# Altium schematic sheet Sender_Power.SchDoc
size A4
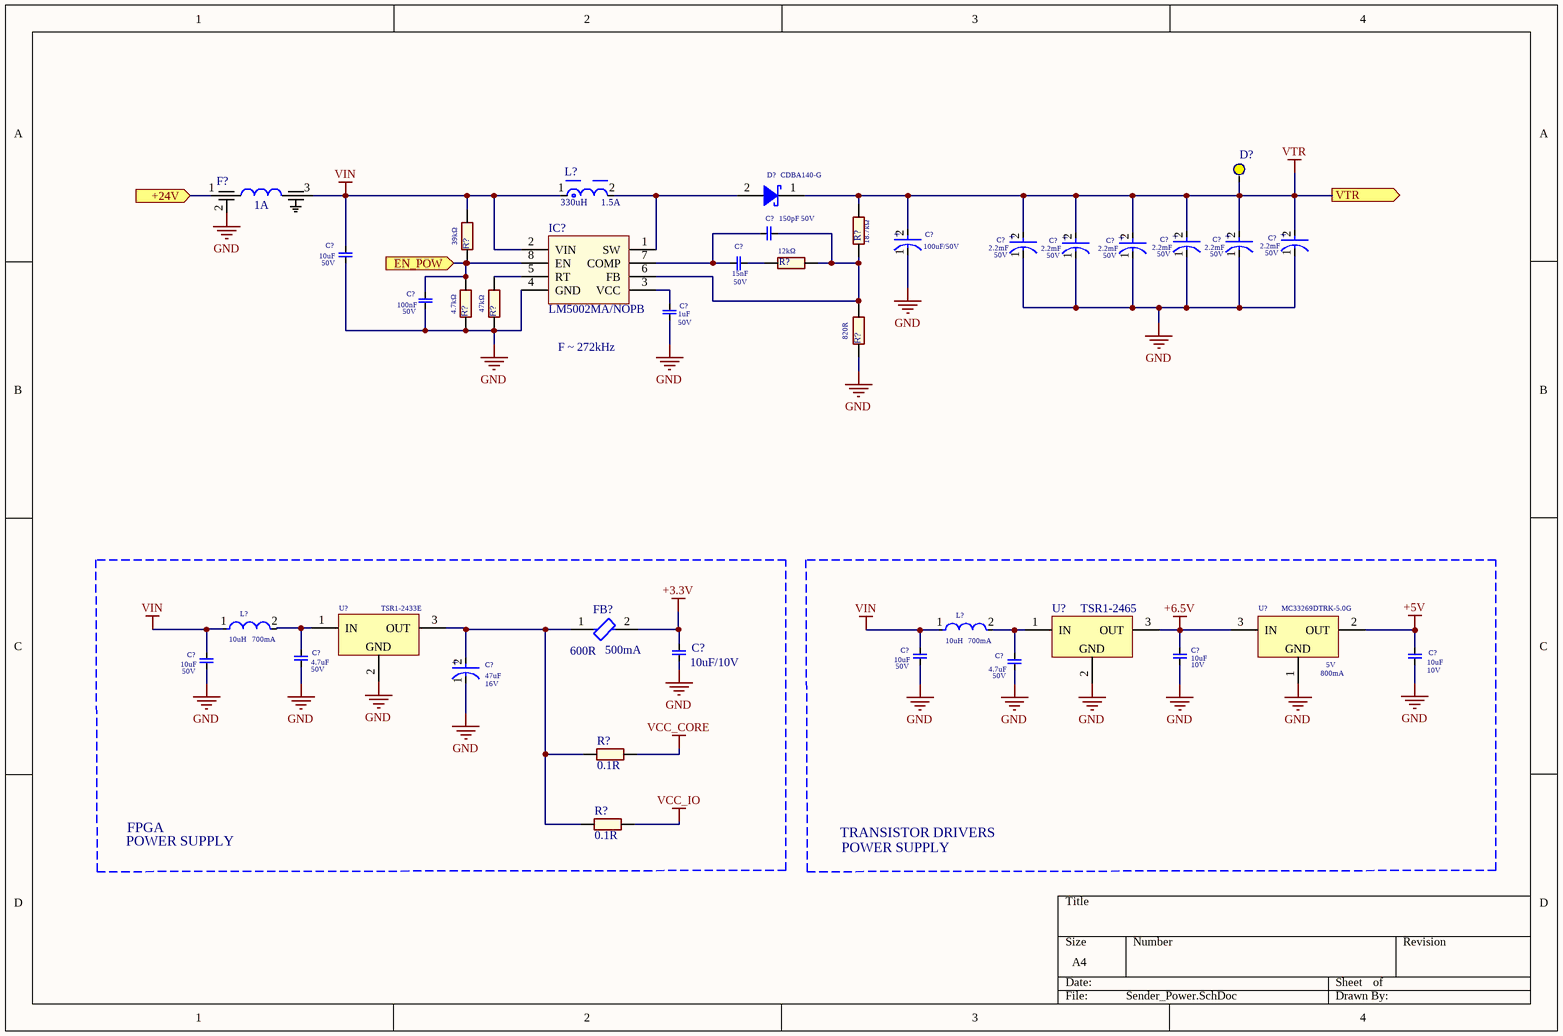
[diagram p0: Sender_Power.SchDoc]

## Parts
(Parts that share a designator on the sheet are numbered #1, #2 ... from top to bottom, then left to right.)
C?#1  100uF/50V  [FP-SGV8X10_5-MFG]
C?#2  Capacitance: 2.2mF  Voltage Rating: 50V  [FP-228CKE050MQW]  (hidden comment: 2200uF/50V)
C?#3  Capacitance: 2.2mF  Voltage Rating: 50V  [FP-228CKE050MQW]  (hidden comment: 2200uF/50V)
C?#4  Capacitance: 2.2mF  Voltage Rating: 50V  [FP-228CKE050MQW]  (hidden comment: 2200uF/50V)
C?#5  Capacitance: 150pF  Voltage Rating: 50V  [FP-CL10-IPC_B]  (hidden comment: 150pF / 50 VDC)
C?#6  Capacitance: 2.2mF  Voltage Rating: 50V  [FP-228CKE050MQW]  (hidden comment: 2200uF/50V)
C?#7  Capacitance: 2.2mF  Voltage Rating: 50V  [FP-228CKE050MQW]  (hidden comment: 2200uF/50V)
C?#8  Capacitance: 2.2mF  Voltage Rating: 50V  [FP-228CKE050MQW]  (hidden comment: 2200uF/50V)
C?#9  Voltage Rating: 50V  Capacitance: 10uF  [CAP-1210 10u/50V]  (hidden comment: 10uF/50V)
C?#10  Capacitance: 15nF  Voltage Rating (DC): 50V  [FP-0603-UMK107BJ104KAHT-IPC_B]  (hidden comment: 15nF / 50 VDC)
C?#11  Voltage Rating: 50V  Capacitance: 100nF  [FP-0603-UMK107BJ104KAHT-IPC_B]  (hidden comment: 100nF/50 VDC)
C?#12  Capacitance: 1uF  Voltage Rating: 50V  [FP-0603-UMK107BJ104KAHT-IPC_B]  (hidden comment: 1uF / 50 VDC)
C?#13  Capacitance: 10uF  Voltage: 50V  [CAP-1210 10u/50V]  (hidden comment: 10uF/50V)
C?#14  Capacitance: 4.7uF  Voltage: 50V  [FP-C2012X7R1H475K125AC-IPC_B]  (hidden comment: 4.7uF/50V)
C?#15  Capacitance: 47uF  Voltage Rating: 16V  [FP-T491C476K016AT-MFG]  (hidden comment: 47uF/16V)
C?#16  10uF/10V  [FP-CL31-IPC_B]
C?#17  Capacitance: 10uF  Voltage: 50V  [CAP-1210 10u/50V]  (hidden comment: 10uF/50V)
C?#18  Capacitance: 10uF  Voltage Rating (DC): 10V  [FP-LMK107BJ106MALTD-IPC_B]  (hidden comment: 10uF/10V)
C?#19  Capacitance: 10uF  Voltage Rating (DC): 10V  [FP-LMK107BJ106MALTD-IPC_B]  (hidden comment: 10uF/10V)
C?#20  Capacitance: 4.7uF  Voltage: 50V  [FP-C2012X7R1H475K125AC-IPC_B]  (hidden comment: 4.7uF/50V)
D?#1  Test_Point  [Test_Point]  (value not drawn)
D?#2  CDBA140-G  [FP-SMA-MFG]
F?  Max DC Current: 1A  [Filter_SBSPP0500]  (hidden comment: FILTER LC(PI) 0.068UF SMD)
FB?  Impedance: 600R  Max DC Current: 500mA  [BLM18AG601SN1D]  (hidden comment: BLM18AG601SN1D)
IC?  Manufacturer Part Number: LM5002MA/NOPB  [D0008A_M]  (hidden comment: IC REG MULTI CONFG ADJ 8SOIC)
L?#1  Inductance: 330uH  RMS Current (Irms): 1.5A  [FP-7447709680-MFG]  (hidden comment: 7447709331)
L?#2  Current Rating: 700mA  Inductance: 10uH  [FP-MLP2520M-IPC_A]  (hidden comment: MLP2520S100MT0S1)
L?#3  Current Rating: 700mA  Inductance: 10uH  [FP-MLP2520M-IPC_A]  (hidden comment: MLP2520S100MT0S1)
R?#1  Resistance: 18.7kΩ  [RES 0603_1608]  (hidden comment: RC0603FR-0718K7L)
R?#2  Resistance: 39kΩ  [RES 0603_1608]  (hidden comment: RC0603FR-0739KL)
R?#3  Resistance: 12kΩ  [RES 0603_1608]
R?#4  Resistance: 4.7kΩ  [RES 0603_1608]  (hidden comment: RC0603FR-074K7L)
R?#5  Resistance: 47kΩ  [RES 0603_1608]
R?#6  Resistance: 820R  [RES 0603_1608]
R?#7  0.1R  [FP-LTR10-low-IPC_B]
R?#8  0.1R  [FP-LTR10-low-IPC_B]
U?#1  Manufacturer Part Number: TSR1-2433E  [TRACO-SIP-3_V]  (hidden comment: DC DC CONVERTER 3.3V)
U?#2  Manufacturer Part Number: TSR1-2465  [TRACO-SIP-3_V]  (hidden comment: TSR 1-2465)
U?#3  Nominal Output Voltage: 5V  Max Output Current: 800mA  [DPAK]  (hidden comment: IC REG LINEAR 5V 800MA DPAK)

## Ports
+24V (in), EN_POW (in), VTR (out)

## Nets
+3.3V: C?#16.1(G) FB?.2
+5V: C?#19.2(G) U?#3.2(OUT)
+6.5V: C?#18.2(G) U?#2.3(OUT) U?#3.3(IN)
GND: C?#1.1(C) C?#2.1(C) C?#3.1(C) C?#4.1(C) C?#6.1(C) C?#7.1(C) C?#8.1(C) C?#9.2(G) C?#11.1(G) C?#12.2(G) C?#13.1(G) C?#14.1(G) C?#15.1(C) C?#16.2(G) C?#17.1(G) C?#18.1(G) C?#19.1(G) C?#20.1(G) F?.2 IC?.4(GND) R?#4.1 R?#5.1 R?#6.1 U?#1.2(GND) U?#2.2(GND) U?#3.1(GND)
VCC_CORE: R?#7.2
VCC_IO: R?#8.2
VIN: C?#9.1(G) C?#13.2(G) C?#17.2(G) F?.3 IC?.2(VIN) L?#1.1 L?#2.1 L?#3.1 R?#2.2
VTR: C?#1.2(A) C?#2.2(A) C?#3.2(A) C?#4.2(A) C?#6.2(A) C?#7.2(A) C?#8.2(A) D?#1.1 D?#2.1(K) R?#1.2 ; port VTR
+24V: F?.1 ; port +24V
EN_POW: C?#11.2(G) IC?.8(EN) R?#2.1 R?#4.2 ; port EN_POW
NetC?#5_1: C?#5.1(G) C?#10.1(G) IC?.7(COMP)
NetC?#5_2: C?#5.2(G) IC?.6(FB) R?#1.1 R?#3.2 R?#6.2
NetC?#10_2: C?#10.2(G) R?#3.1
NetC?#12_1: C?#12.1(G) IC?.3(VCC)
NetC?#14_2: C?#14.2(G) L?#2.2 U?#1.1(IN)
NetC?#15_2: C?#15.2(A) FB?.1 R?#7.1 R?#8.1 U?#1.3(OUT)
NetC?#20_2: C?#20.2(G) L?#3.2 U?#2.1(IN)
NetD?#2_2: D?#2.2(A) IC?.1(SW) L?#1.2
NetIC?_5: IC?.5(RT) R?#5.2

## Notes on the sheet
- F ~ 272kHz
- POWER SUPPLY
- FPGA
- TRANSISTOR DRIVERS
- (in symbol 50SEV100M8X10.5) +
- (in symbol 228CKE050MQW) +
- (in symbol T491C476K016AT) +

## Library data of the parts
C?#1 = 50SEV100M8X10.5: 100 µF 50 V Aluminum Electrolytic Capacitors Radial, Can - SMD 2000 Hrs @ 85°C; Manufacturer: Rubycon; Tolerance: 20%; Capacitance: 100uF; Life (Hours): 2000Hour; Polarity: Polar; Q Factor: 0.12; Ripple Current: 320mA; Voltage Rating: 50V; Packaging: Tape and Reel; Height - Seated (Max): 0.413inch; ComponentLink1URL: https://datasheet.ciiva.com/6317/sev-series-6317454.pdf?src-supplier=Digi-Key; ComponentLink1Description: https://datasheet.ciiva.com/6317/sev-series-6317454.pdf?src-supplier=Digi-Key; Supplier 1: Digi-Key; Supplier Part Number 1: 1189-3099-1-ND; Case/Package: Radial; Category: Aluminum Electrolytic Capacitors; Construction: Cylindrical; Diameter: 8mm; Height: 10.5mm; Lead Free: Lead Free; Manufacturer Part Number: 50SEV100M8X10.5; Max Operating Temperature: 85°C; Min Operating Temperature: -40°C; Mount: Surface Mount; Package Quantity: 500; Radiation Hardening: No; RoHS Compliant: Yes; Series: SEV
C?#2-C?#4 C?#6-C?#8 = 228CKE050MQW: 2200 µF 50 V Aluminum Electrolytic Capacitors Radial, Can 105.5mOhm @ 120Hz 2000 Hrs @ 105°C; Manufacturer: CDE Illinois Capacitor; Tolerance: 20%; ESR (Equivalent Series Resistance): 105.5mR; Ripple Current: 1.41A; Life (Hours): 2000Hour; Polarity: Polar; Supplier 1: Digi-Key; Supplier Part Number 1: 1572-1107-ND; Manufacturer Part Number: 228CKE050MQW; Category: Aluminum Electrolytic Capacitors; Packaging: Bulk; Height - Seated (Max): 1.24inch; ComponentLink1URL: https://datasheet.ciiva.com/14585/70111748-14585886.pdf?src-supplier=Allied+Electronics; ComponentLink1Description: https://datasheet.ciiva.com/14585/70111748-14585886.pdf?src-supplier=Allied+Electronics; Voltage Rating (DC): 50V; Case/Package: Radial; Lead Pitch: 0.295inch; Max Operating Temperature: 105°C; Min Operating Temperature: -40°C; Mount: Through Hole,PCB; Package Quantity: 50
C?#5 = CL10C151JB8NNNC: 150 pF ±5% 50V Ceramic Capacitor C0G, NP0 0603 (1608 Metric); Manufacturer: Samsung; Temperature Coefficient: 300ppm/°C; Width: 0.031inch; Case Code (Imperial): 0603; Case Code (Metric): 1608; Case/Package: 0603; Category: Ceramic Capacitors; Construction: Flat; Contact Plating: Tin; Depth: 0.8mm; Dielectric: C0G; Height: 0.8mm; Lead Free: Lead Free; Length: 1.6mm; Manufacturer Part Number: CL10C151JB8NNNC; Max Operating Temperature: 125°C; Min Operating Temperature: -55°C; Mount: Surface Mount; Package Quantity: 1; Packaging: Tape and Reel; Radiation Hardening: No; RoHS Compliant: Yes; Series: CL; Thickness: 0.035inch; Tolerance: 5%; Voltage Rating (DC): 50V; ComponentLink1URL: https://datasheet.ciiva.com/15195/getdatasheetpartid-354057-15195800.pdf?src-supplier=Verical; ComponentLink1Description: https://datasheet.ciiva.com/15195/getdatasheetpartid-354057-15195800.pdf?src-supplier=Verical; Material: Ceramic; Voltage: 50V
C?#9 C?#13 C?#17 = CL32B106KBJNNNE: 10 µF 50V ±10%  Ceramic Capacitor X7R 1210 (3225 Metric); Manufacturer: Samsung; Packaging: Tape and Reel; Tolerance: 10%; ComponentLink1URL: https://datasheet.ciiva.com/25766/cl32b106kbjnnne-25766545.pdf?src-supplier=Digi-Key; ComponentLink1Description: https://datasheet.ciiva.com/25766/cl32b106kbjnnne-25766545.pdf?src-supplier=Digi-Key; Supplier 1: Mouser; Supplier Part Number 1: 187-CL32B106KBJNNNE; Supplier 2: Mouser; Case Code (Imperial): 1210; Case Code (Metric): 3225; Case/Package: 1210; Category: Ceramic Capacitors; Construction: Flat; Depth: 2.5mm; Dielectric: X7R; Height: 2.5mm; Lead Free: Lead Free; Length: 3.2mm; Manufacturer Part Number: CL32B106KBJNNNE; Material: Ceramic; Max Operating Temperature: 125°C; Min Operating Temperature: -55°C; Mount: Surface Mount; Package Quantity: 1; Radiation Hardening: No; RoHS Compliant: Yes; Series: CL; Thickness: 0.106inch; Voltage Rating (DC): 50V; Width: 0.098inch; Supplier Packaging 1: Tape & Reel; Supplier Unit Price 1: $0.59; Supplier Location 1: US; Supplier Part Number 2: 187-CL32B106KBJNNNE
  C?#9: Voltage: 50V
  C?#13 C?#17: Voltage Rating: 50V
C?#10 = CGA3E2X7R1H153K080AA: 15 nF 50V ±10%  Ceramic Capacitor X7R 0603 (1608 Metric); Manufacturer: TDK; Packaging: Tape and Reel; Tolerance: 10%; ComponentLink1URL: https://datasheet.ciiva.com/24219/cga3e2x7r1h153k080aa-266046-24219120.pdf?src-supplier=Mouser; ComponentLink1Description: https://datasheet.ciiva.com/24219/cga3e2x7r1h153k080aa-266046-24219120.pdf?src-supplier=Mouser; Case Code (Imperial): 0603; Case Code (Metric): 1608; Case/Package: 0603; Category: Ceramic Capacitors; Depth: 0.8mm; Dielectric: X7R; Height: 0.8mm; Length: 1.6mm; Manufacturer Part Number: CGA3E2X7R1H153K080AA; Max Operating Temperature: 125°C; Min Operating Temperature: -55°C; Mount: Surface Mount; Package Quantity: 1; RoHS Compliant: Yes; Series: CGA; Thickness: 0.035inch; Voltage Rating: 50V; Width: 0.031inch; Ratings: AEC-Q200; Resistor Type: Ceramic; Termination: SMD/SMT; Weight: 7.1E-05oz; Supplier 1: Digi-Key; Supplier 2: Mouser; Supplier Part Number 1: 445-6923-1-ND; Supplier Part Number 2: 810-CGA3E2X7R1H153K
C?#11 = UMK107BJ104KAHT: 0.1 µF 50V  ±10% Ceramic Capacitor X5R 0603 (1608 Metric); Manufacturer: Taiyo Yuden; Packaging: Tape and Reel; Tolerance: 10%; Ratings: AEC-Q200; ComponentLink1URL: https://datasheet.ciiva.com/18697/mlcc01-hq-e-18697861.pdf?src-supplier=Digi-Key; ComponentLink1Description: https://datasheet.ciiva.com/18697/mlcc01-hq-e-18697861.pdf?src-supplier=Digi-Key; Supplier 1: Mouser; Supplier Part Number 1: 963-UMK107BJ104KAHT; Case Code (Imperial): 0603; Case Code (Metric): 1608; Case/Package: 0603; Category: Ceramic Capacitors; Dielectric: X5R; Halogen Free: Halogen Free; Height: 0.8mm; Lead Free: Lead Free; Length: 0.063inch; Manufacturer Part Number: UMK107BJ104KAHT; Max Operating Temperature: 85°C; Min Operating Temperature: -55°C; Mount: Surface Mount; Package Quantity: 4000; RoHS Compliant: Yes; Termination: SMD/SMT; Thickness: 0.035inch; Voltage Rating (DC): 50V; Width: 0.031inch; Supplier 2: Digi-Key; Supplier Part Number 2: 587-3504-6-ND
C?#12 = UMK107BJ105KA-T: 1 µF ±10% 50V Ceramic Capacitor X5R 0603 (1608 Metric); Manufacturer: Taiyo Yuden; Packaging: Tape and Reel; Tolerance: 10%; ComponentLink1URL: https://datasheet.ciiva.com/134/umk107bj105ka-t-ss-134740.pdf?src-supplier=Digi-Key; ComponentLink1Description: https://datasheet.ciiva.com/134/umk107bj105ka-t-ss-134740.pdf?src-supplier=Digi-Key; Supplier 1: Digi-Key; Supplier Part Number 1: 587-2400-1-ND; Case Code (Imperial): 0603; Case Code (Metric): 1608; Case/Package: 0603; Category: Ceramic Capacitors; Construction: Flat; Contact Plating: Nickel; Depth: 0.8mm; Dielectric: X5R; Halogen Free: Halogen Free; Height: 0.8mm; Length: 1.6mm; Manufacturer Part Number: UMK107BJ105KA-T; Max Operating Temperature: 85°C; Min Operating Temperature: -55°C; Mount: Surface Mount; Number of Pins: 2; Package Quantity: 1; Radiation Hardening: No; REACH SVHC: Unknown; RoHS Compliant: Yes; Series: M; Termination: SMD/SMT; Thickness: 0.035inch; Voltage Rating (DC): 50V; Width: 0.031inch; Supplier 2: Mouser; Supplier Part Number 2: 963-UMK107BJ105KA-T
C?#14 C?#20 = C2012X7R1H475K125AC: 4.7uF 50V 10% 0805 T/R Multilayer Ceramic Capacitor; Manufacturer: TDK; Category: Ceramic Capacitors; Manufacturer Part Number: C2012X7R1H475K125AC; RoHS Compliant: No; Supplier 1: Digi-Key; RoHS: Yes; Stock 1: 123424; Pricing 1: 1=0.57000, 10=0.40600, 50=0.30680, 100=0.26730, 500=0.19800, 1000=0.16830 (USD); Supplier 2: Mouser; Supplier Part Number 2: 810-C2012X7R475K125C; Supplier Part Number 1: 445-C2012X7R1H475K125ACCT-ND
C?#15 = T491C476K016AT: 47 µF Molded Tantalum Capacitors 16 V 2312 (6032 Metric) 1.2Ohm; Manufacturer: KEMET; Dissipation Factor: 6%; ESR (Equivalent Series Resistance): 1.2R; Leakage Current: 7.5uA; Life (Hours): 2000Hour; Polarity: Polar; Ripple Current: 303mA; Tolerance: 20%; Voltage: 6V; Case Code (Imperial): 2312; Case Code (Metric): 6032; Case/Package: Molded; Category: Tantalum Capacitors; Depth: 3.2mm; Dielectric Material: Tantalum; Failure Rate: 0.001%; Features: General Purpose; Height: 2.5mm; Height - Seated (Max): 0.11inch; Lead Free: Lead Free; Length: 6mm; Manufacturer Part Number: T491C476K016AT; Max Operating Temperature: 125°C; Min Operating Temperature: -55°C; Mount: Surface Mount; Number of Pins: 2; Package Quantity: 1; Packaging: Tape and Reel; Radiation Hardening: No; REACH SVHC: No SVHC; RoHS Compliant: Yes; Termination: SMD/SMT; Voltage Rating (DC): 16V; Width: 3.2mm; ComponentLink1URL: https://datasheet.ciiva.com/6228/kem-t2005-t491-6228421.pdf?src-supplier=Digi-Key; ComponentLink1Description: https://datasheet.ciiva.com/6228/kem-t2005-t491-6228421.pdf?src-supplier=Digi-Key
C?#16 = CL31B225KBHVPNE: Cap Ceramic 2.2uF 50V X7R ±10% SMD 1206 +125°C Embossed T/R; Width: 0.063inch; Case/Package: 1206; Tolerance: 10%; Mount: Surface Mount; Capacitance: 2.2uF; Ratings: AEC-Q200; Thickness: 0.071inch; Voltage Rating: 50V; Features: Soft Termination; Case Code (Metric): 3216; Length: 0.126inch; Packaging: Tape and Reel; Max Operating Temperature: 125°C; Min Operating Temperature: -55°C; Case Code (Imperial): 1206; Dielectric: X7R
C?#18 C?#19 = LMK107BJ106MALTD: 10 µF 10V ±20%  Ceramic Capacitor X5R 0603 (1608 Metric); Manufacturer: Taiyo Yuden; Width: 0.031inch; Case/Package: 0603; Tolerance: 20%; Mount: Surface Mount; Thickness: 0.035inch; Voltage Rating: 10V; Case Code (Metric): 1608; Length: 1.6mm; Packaging: Tape and Reel; Max Operating Temperature: 85°C; Min Operating Temperature: -55°C; Case Code (Imperial): 0603; Dielectric: X5R; Category: Ceramic Capacitors; Construction: Flat; Height: 0.8mm; Lead Free: Lead Free; Manufacturer Part Number: LMK107BJ106MALTD; Number of Pins: 2; Package Quantity: 4000; REACH SVHC: No SVHC; Resistor Type: Ceramic; RoHS Compliant: Yes; Series: M; Termination: SMD/SMT; ComponentLink1URL: https://datasheet.ciiva.com/140/mlcc-all-e-140193.pdf?src-supplier=Digi-Key; ComponentLink1Description: https://datasheet.ciiva.com/140/mlcc-all-e-140193.pdf?src-supplier=Digi-Key; Supplier 1: Digi-Key; Supplier 2: Mouser; Supplier Part Number 1: 587-2562-6-ND; Supplier Part Number 2: 963-LMK107BJ106MALTD
D?#2 = CDBA140-G: Diode Schottky 40 V 1A Surface Mount DO-214AC (SMA); Manufacturer: Comchip; Voltage Rating (DC): 40V; Max Reverse Leakage Current: 500uA; Max Surge Current: 30A; Polarity: Standard; Supplier 1: Digi-Key; Supplier Part Number 1: 641-1015-1-ND; Packaging: Tape and Reel; ComponentLink1URL: https://datasheet.ciiva.com/912/cdba120-gthru934256-cdba1100-grevc-912051.pdf?src-supplier=Digi-Key; ComponentLink1Description: https://datasheet.ciiva.com/912/cdba120-gthru934256-cdba1100-grevc-912051.pdf?src-supplier=Digi-Key; Average Rectified Current: 1A; Case/Package: DO-214AC; Category: Rectifier Diodes; Current Rating: 1A; Lead Free: Lead Free; Max Reverse Voltage (DC): 40V; Mount: Surface Mount; Output Current: 1A; Package Quantity: 1; RoHS Compliant: Yes; Supplier 2: Mouser; Supplier Part Number 2: 750-CDBA140-G; Manufacturer Part Number: CDBA140-G
F? = SBSPP0500683MX: LC (Pi) EMI Filter 3rd Order Low Pass 1 Channel C = 0.068µF 1 A 1206 (3216 Metric), 3 PC Pad; Manufacturer: Knowles Syfer; Manufacturer Part Number: SBSPP0500683MXT; Capacitance: 68nF; DC Resistance (DCR): 500mR; Tolerance: 20%; Voltage Rating (DC): 50V; Case/Package: 1206; Category: Capacitors; Circuit Type: Filter; Current Rating: 1A; Height: 1.6mm; Length: 3.2mm; Max Operating Temperature: 125°C; Min Operating Temperature: -55°C; Package Quantity: 1500; Packaging: Tape and Reel; Termination: SMD/SMT; Width: 1.6mm; ComponentLink1URL: https://www.knowlescapacitors.com/getattachment/d832ef33-ec0f-45c7-8006-dfb1282e2264/SBSP-SBSPP-1A.aspx?src-supplier=Digi-Key; ComponentLink1Description: https://www.knowlescapacitors.com/getattachment/d832ef33-ec0f-45c7-8006-dfb1282e2264/SBSP-SBSPP-1A.aspx?src-supplier=Digi-Key; Supplier 1: Digi-Key; Supplier Part Number 1: 1608-1205-1-ND
FB? = BLM18AG601SN1D: 600 Ohms @ 100 MHz 1 Ferrite Bead 0603 (1608 Metric) 500mA 380mOhm; Manufacturer: Murata; DC Resistance (DCR): 380mR; Frequency: 100MHz; Material: Steel,Ferrite; Number of Circuits: 1; Shielding: Unshielded; Tolerance: 25%; Supplier Part Number 2: 81-BLM11A601S; Case Code (Imperial): 0603; Case Code (Metric): 1608; Case/Package: 0603; Category: Inductors; Core Material: Ferrite; Current Rating: 500mA; DC Current: 500mA; Depth: 0.8mm; Height: 0.8mm; Lead Free: Lead Free; Length: 1.6mm; Max Current Rating: 500mA; Max Operating Temperature: 125°C; Military Standard: Not; Min Operating Temperature: -55°C; Number of Lines: 1; Number of Pins: 2; Package Quantity: 1; Packaging: Tape and Reel; Radiation Hardening: No; REACH SVHC: No SVHC; RoHS Compliant: Yes; Termination: SMD/SMT; Test Frequency: 100MHz; Weight: 7.1E-05oz; Width: 0.8mm; Supplier 1: Digi-Key; Supplier Part Number 1: 490-1014-1-ND; Supplier Packaging 1: Cut Tape; Supplier Unit Price 1: $0.10; Supplier Location 1: US; Supplier 2: Mouser; Supplier Packaging 2: Tape & Reel; Supplier Unit Price 2: $0.13; Supplier Location 2: US; Supplier 3: Farnell; Supplier Part Number 3: 1515679; Supplier Packaging 3: Cut Tape; Supplier Unit Price 3: £0.027; Supplier Location 3: GB; Manufacturer Part Number: BLM18AG601SN1D
IC? = LM5002MAX/NOPB: Boost, Flyback, Forward Converter, SEPIC Switching Regulator IC Positive, Isolation Capable Adjustable 3.1V 1 Output 400mA (Switch) 8-SOIC (0.154", 3.90mm Width); Manufacturer: TI National Semiconductor; Topology: Boost,Flyback,SEPIC; Number of Outputs: 1; Synchronous Rectifier: No; Efficiency: 96%; Max Input Voltage: 75V; Min Output Voltage: 1.26V; Output Current: 500mA; Quiescent Current: 3.1mA; Switching Frequency: 1.5MHz; Packaging: Rail/Tube; Output Type: Adjustable; ComponentLink1URL: https://datasheet.ciiva.com/6596/lm5002-6596406.pdf?src-supplier=Digi-Key; ComponentLink1Description: https://datasheet.ciiva.com/6596/lm5002-6596406.pdf?src-supplier=Digi-Key; Width: 3.9mm; Case/Package: SOIC; Category: Voltage Regulators - Switching; Height: 1.45mm; Lead Free: Lead Free; Length: 4.9mm; Max Operating Temperature: 125°C; Max Output Voltage: 75V; Min Input Voltage: 3.1V; Min Operating Temperature: -40°C; Min Supply Voltage: 3.1V; Mount: Surface Mount; Number of Pins: 8; Operating Supply Voltage: 75V; Output Voltage: 75V; Package Quantity: 95; Radiation Hardening: No; REACH SVHC: No SVHC; RoHS Compliant: Yes; Series: LM5002
L?#1 = 7447709331: FIXED IND 330UH 1.5A 430MOHM SMD; Manufacturer: Wurth Electronics; Core Material: Ferrite; DC Resistance (DCR): 430mR; Inductance Tolerance: 20%; Saturation Current: 1.7A; Self Resonant Frequency: 2MHz; Shielding: Shielded; Test Frequency: 1kHz; Supplier 1: Digi-Key; Supplier Part Number 1: 732-1698-1-ND; Supplier Unit Price 1: $2.57; Case Code (Imperial): 1210; Case Code (Metric): 3225; Case/Package: Nonstandard; Category: Fixed Inductors; Current Rating: 1.5A; Depth: 12mm; Height: 10mm; Height - Seated (Max): 0.394inch; Lead Free: Lead Free; Lead Pitch: 7mm; Length: 12mm; Max DC Current: 1.5A; Max Operating Temperature: 125°C; Min Operating Temperature: -40°C; Mount: Surface Mount; Package Quantity: 250; Packaging: Tape and Reel; REACH SVHC: Unknown; Resistance: 430mR; Resistor Type: Wirewound; RoHS Compliant: Yes; Series: WE-PD; Series Resistance: 430mR; Termination: SMD/SMT; Tolerance: 20%; Width: 12mm; Supplier Packaging 1: Cut Tape; Supplier Location 1: US; Supplier 2: Mouser; Supplier Part Number 2: 710-7447709331; Supplier Packaging 2: Tape & Reel; Supplier Unit Price 2: $2.57; Supplier Location 2: US; Supplier 3: Farnell; Supplier Part Number 3: 2082655; Supplier Packaging 3: Cut Tape; Supplier Unit Price 3: £1.88; Supplier Location 3: GB; Manufacturer Part Number: 7447709331
L?#2 L?#3 = MLP2520S100MT0S1: 10 µH Shielded Multilayer Inductor 700 mA 364mOhm Max 1008 (2520 Metric); Manufacturer: TDK; Core Material: Ferrite; DC Resistance (DCR): 364mR; Test Frequency: 2MHz; Tolerance: 20%; Supplier Location 2: US; Case Code (Imperial): 1008; Case Code (Metric): 2520; Case/Package: 1008; Category: Fixed Inductors; Height - Seated (Max): 0.047inch; Length: 0.098inch; Max Operating Temperature: 125°C; Min Operating Temperature: -40°C; Mount: Surface Mount; Package Quantity: 3000; Packaging: Tape and Reel; RoHS Compliant: Yes; Shielding: Shielded; Width: 0.079inch; Supplier 1: Digi-Key; Supplier Part Number 1: 445-9504-1-ND; Supplier Packaging 1: Cut Tape; Supplier Unit Price 1: $0.40; Supplier Location 1: US; Supplier 2: Mouser; Supplier Part Number 2: 810-MLP2520S100MT0S1; Supplier Packaging 2: Tape & Reel; Supplier Unit Price 2: $0.41; Supplier 3: Farnell; Supplier Part Number 3: 3386718; Supplier Unit Price 3: £0.229; Supplier Location 3: GB; Manufacturer Part Number: MLP2520S100MT0S1
R?#1 = RC0603FR-0718K7L: 18.7 kOhms ±1% 0.1W, 1/10W Chip Resistor 0603 (1608 Metric) Moisture Resistant Thick Film; Manufacturer: Yageo; Category 1: Resistors; Max Power Dissipation: 100mW; Temperature Coefficient: 100ppm/°C; Voltage Rating: 50V; Series: RC; Case Code (Imperial): 0603; Case Code (Metric): 1608; Case/Package: 0603; Category: Chip SMD Resistors; Construction: Rectangular; Depth: 0.8mm; Features: Moisture Resistant; Height: 0.45mm; Lead Free: Lead Free; Length: 1.6mm; Max Operating Temperature: 155°C; Military Standard: Not; Min Operating Temperature: -55°C; Number of Terminations: 2; Package Quantity: 5000; Packaging: Tape and Reel; Power Rating: 100mW; Resistor Type: Thick Film; RoHS Compliant: Yes; Size Code: 0603; Termination: SMD/SMT; Tolerance: 1%; Voltage Rating (DC): 50V; Width: 0.8mm; Supplier 1: Digi-Key; Supplier Part Number 1: 311-18.7KHRCT-ND; Supplier Packaging 1: Cut Tape; Supplier Unit Price 1: $0.10; Supplier Location 1: US; Manufacturer Part Number: RC0603FR-0718K7L
R?#2 = RC0603FR-0739KL: 39 kOhms ±1% 0.1W, 1/10W Chip Resistor 0603 (1608 Metric) Moisture Resistant Thick Film; Manufacturer: Yageo; Temperature Coefficient: 100ppm/°C; Power Rating: 100mW; Voltage Rating: 50V; Supplier 1: Digi-Key; Supplier Part Number 1: 311-39.0KHRCT-ND; Packaging: Tape and Reel; Tolerance: 1%; Features: Moisture Resistant; Height: 0.45mm; Supplier 2: Mouser; Supplier Part Number 2: 603-RC0603FR-0739KL; Length: 1.6mm; Series: RC; Width: 0.8mm; Voltage Rating (DC): 50V; Case Code (Imperial): 0603; Case Code (Metric): 1608; Case/Package: 0603; Category: Chip SMD Resistors; Construction: Rectangular; Depth: 0.8mm; Lead Free: Lead Free; Max Operating Temperature: 155°C; Max Power Dissipation: 100mW; Military Standard: Not; Min Operating Temperature: -55°C; Number of Pins: 2; Number of Terminations: 2; REACH SVHC: No SVHC; Resistance Tolerance: 1%; Resistor Type: Thick Film; RoHS Compliant: Yes; Size Code: 0603; Technology: THICK FILM; Termination: SMD/SMT; Supplier Packaging 1: Cut Tape; Supplier Unit Price 1: $0.10; Supplier Location 1: US; Supplier Packaging 2: Tape & Reel; Supplier Unit Price 2: $0.10; Supplier Location 2: US; Supplier 3: Farnell; Supplier Part Number 3: 9238670; Supplier Packaging 3: Cut Tape; Supplier Unit Price 3: £0.013; Supplier Location 3: GB; Manufacturer Part Number: RC0603FR-0739KL
R?#3 = RC0603FR-0712KL: 12 kOhms ±1% 0.1W, 1/10W Chip Resistor 0603 (1608 Metric) Moisture Resistant Thick Film; Manufacturer: Yageo; Category 1: Resistors; Max Power Dissipation: 100mW; Temperature Coefficient: 100ppm/°C; Voltage Rating: 50V; Width: 0.8mm; Case Code (Imperial): 0603; Case Code (Metric): 1608; Case/Package: 0603; Category: Chip SMD Resistors; Construction: Rectangular; Depth: 0.8mm; Features: Moisture Resistant; Height: 0.022inch; Lead Free: Lead Free; Length: 1.6mm; Max Operating Temperature: 155°C; Military Standard: Not; Min Operating Temperature: -55°C; Number of Pins: 2; Number of Terminations: 2; Package Quantity: 1; Packaging: Tape and Reel; Power Rating: 100mW; REACH SVHC: No SVHC; Resistance Tolerance: 1%; Resistor Type: Thick Film; RoHS Compliant: Yes; Series: RC; Size Code: 0603; Termination: SMD/SMT; Tolerance: 1%; Voltage Rating (DC): 50V; Supplier 1: Digi-Key; Supplier Part Number 1: 311-12.0KHRCT-ND; Supplier Packaging 1: Cut Tape; Supplier Unit Price 1: $0.10; Supplier Location 1: US; Supplier 2: Farnell; Supplier Part Number 2: 9238611; Supplier Packaging 2: Cut Tape; Supplier Unit Price 2: £0.013; Supplier Location 2: GB; Manufacturer Part Number: RC0603FR-0712KL
R?#4 = RC0603FR-074K7L: 4.7 kOhms ±1% 0.1W, 1/10W Chip Resistor 0603 (1608 Metric) Moisture Resistant Thick Film; Manufacturer: Yageo; Temperature Coefficient: 100ppm/°C; Power Rating: 100mW; Voltage Rating: 50V; Supplier 1: Digi-Key; Supplier Part Number 1: 311-4.70KHRCT-ND; Packaging: Tape and Reel; Tolerance: 1%; Features: Moisture Resistant; Height: 0.45mm; Supplier 2: Mouser; Supplier Part Number 2: 603-RC0603FR-074K7L; Length: 1.6mm; Series: RC; Width: 0.8mm; Case Code (Imperial): 0603; Case Code (Metric): 1608; Case/Package: 0603; Category: Chip SMD Resistors; Construction: Rectangular; Depth: 0.8mm; Lead Free: Lead Free; Lead Pitch: 0.3mm; Max Operating Temperature: 155°C; Max Power Dissipation: 100mW; Military Standard: Not; Min Operating Temperature: -55°C; Number of Pins: 2; Number of Terminations: 2; REACH SVHC: No SVHC; Resistance Tolerance: 1%; Resistor Type: Thick Film; RoHS Compliant: Yes; Size Code: 0603; Termination: SMD/SMT; Voltage Rating (DC): 50V; Supplier Packaging 1: Cut Tape; Supplier Unit Price 1: $0.10; Supplier Location 1: US; Supplier Packaging 2: Tape & Reel; Supplier Unit Price 2: $0.10; Supplier Location 2: US; Supplier 3: Farnell; Supplier Part Number 3: 9238565; Supplier Packaging 3: Cut Tape; Supplier Unit Price 3: £0.0198; Supplier Location 3: GB; Manufacturer Part Number: RC0603FR-074K7L
R?#5 = RC0603FR-0747KL: 47 kOhms ±1% 0.1W, 1/10W Chip Resistor 0603 (1608 Metric) Moisture Resistant Thick Film; Manufacturer: Yageo; Category 1: Resistors; Voltage Rating (DC): 50V; Max Power Dissipation: 100mW; Temperature Coefficient: 100ppm/°C; Case Code (Imperial): 0603; Case Code (Metric): 1608; Case/Package: 0603; Category: Chip SMD Resistors; Construction: Rectangular; Depth: 0.8mm; Features: Moisture Resistant; Height: 0.022inch; Lead Free: Lead Free; Length: 1.6mm; Max Operating Temperature: 155°C; Military Standard: Not; Min Operating Temperature: -55°C; Number of Pins: 2; Number of Terminations: 2; Package Quantity: 1; Packaging: Tape and Reel; Power Rating: 100mW; REACH SVHC: Unknown; Resistance Tolerance: 1%; Resistor Type: Thick Film; RoHS Compliant: Yes; Series: RC; Size Code: 0603; Technology: THICK FILM; Termination: SMD/SMT; Tolerance: 1%; Voltage Rating: 50V; Width: 0.031inch; Supplier 1: Digi-Key; Supplier Part Number 1: 311-47.0KHRCT-ND; Supplier Packaging 1: Cut Tape; Supplier Unit Price 1: $0.10; Supplier Location 1: US; Supplier 2: Mouser; Supplier Part Number 2: 603-RC0603FR-0747KL; Supplier Packaging 2: Tape & Reel; Supplier Unit Price 2: $0.10; Supplier Location 2: US; Supplier 3: Farnell; Supplier Part Number 3: 9238689; Supplier Packaging 3: Cut Tape; Supplier Unit Price 3: £0.013; Supplier Location 3: GB; Manufacturer Part Number: RC0603FR-0747KL
R?#6 = RC0603FR-07820RL: 820 Ohms ±1% 0.1W, 1/10W Chip Resistor 0603 (1608 Metric) Moisture Resistant Thick Film; Manufacturer: Yageo; Category 1: Resistors; Max Power Dissipation: 100mW; Temperature Coefficient: 100ppm/°C; Voltage Rating: 75V; Voltage Rating (DC): 50V; Supplier 2: Mouser; Case Code (Imperial): 0603; Case Code (Metric): 1608; Case/Package: 0603; Category: Chip SMD Resistors; Construction: Rectangular; Depth: 0.8mm; Features: Moisture Resistant; Height: 0.45mm; Lead Free: Lead Free; Length: 1.6mm; Max Operating Temperature: 155°C; Military Standard: Not; Min Operating Temperature: -55°C; Number of Pins: 2; Number of Terminations: 2; Packaging: Tape and Reel; Power Rating: 100mW; REACH SVHC: Unknown; Resistance Tolerance: 1%; Resistor Type: Thick Film; RoHS Compliant: Yes; Series: RC; Size Code: 0603; Technology: THICK FILM; Termination: SMD/SMT; Tolerance: 1%; Weight: 7.1E-05oz; Width: 0.8mm; Supplier 1: Digi-Key; Supplier Part Number 1: 311-820HRCT-ND; Supplier Packaging 1: Cut Tape; Supplier Unit Price 1: $0.10; Supplier Location 1: US; Supplier Part Number 2: 603-RC0603FR-07820RL; Supplier Packaging 2: Tape & Reel; Supplier Unit Price 2: $0.10; Supplier Location 2: US; Supplier 3: Farnell; Supplier Part Number 3: 9238476; Supplier Packaging 3: Cut Tape; Supplier Unit Price 3: £0.013; Supplier Location 3: GB; Manufacturer Part Number: RC0603FR-07820RL
R?#7 R?#8 = LTR10EVHFLR100: 100 mOhms ±1% 0.5W, 1/2W Chip Resistor Wide 0805 (2012 Metric), 0508 Automotive AEC-Q200, Current Sense Thick Film; Manufacturer: Rohm; Max Power Dissipation: 500mW; Resistance: 100mR; Temperature Coefficient: 150ppm/°C; Case Code (Imperial): 0805; Case Code (Metric): 2012; Case/Package: 0805; Category: Chip SMD Resistors; Features: Automotive AEC-Q200; Height: 0.026inch; Lead Free: Lead Free; Length: 0.047inch; Manufacturer Part Number: LTR10EVHFLR100; Max Operating Temperature: 155°C; Min Operating Temperature: -55°C; Number of Terminations: 2; Package Quantity: 1; Packaging: Tape and Reel; Resistor Type: Thick Film; RoHS Compliant: Yes; Series: LTR; Tolerance: 1%; Width: 0.079inch; ComponentLink1URL: https://datasheet.ciiva.com/2480/ltr-low-2480848.pdf?src-supplier=Digi-Key; ComponentLink1Description: https://datasheet.ciiva.com/2480/ltr-low-2480848.pdf?src-supplier=Digi-Key; Supplier 1: Digi-Key; Supplier 2: Mouser; Supplier Part Number 1: RHM.10BSCT-ND; Supplier Part Number 2: 755-LTR10EVHFLR100
U?#1 = TSR 1-2433E: Non-Isolated PoL Module DC DC Converter 1 Output 3.3V 1A 6V - 36V Input; Manufacturer: Traco Power; Supplier 1: Digi-Key; Supplier 2: Mouser; Supplier Part Number 1: 1951-TSR1-2433E-ND; Supplier Part Number 2: 495-TSR1-2433E
U?#2 = TSR 1-2465: Linear Regulator Replacement DC DC Converter 1 Output 6.5V 1A 9V - 36V Input; Manufacturer: Traco Power; Efficiency: 87%; Isolation: Isolated; Max Input Voltage (DC): 32V; Max Output Power: 6.5W; Number of Outputs: 1; Width: 7.6mm; Case/Package: SIP; Category: Voltage Regulators - Switching; Depth: 7.6mm; Height: 10.2mm; Length: 11.7mm; Max Input Voltage: 36V; Max Operating Temperature: 85°C; Max Output Current: 1A; Min Input Voltage: 9V; Min Input Voltage (DC): 9V; Min Operating Temperature: -40°C; Mount: Through Hole; Nominal Output Voltage: 6.5V; Number of Pins: 3; Output Current: 1A; Output Voltage: 6.5V; Power Rating: 6.5W; Radiation Hardening: No; REACH SVHC: No SVHC; RoHS Compliant: Yes; Series: TSR 1; Weight: 1.9g; ComponentLink1URL: https://datasheet.ciiva.com/26336/156674-da-01-en-dc-dc-wandler-1a-tsr-1-2465-26336400.pdf?src-supplier=Conrad; ComponentLink1Description: https://datasheet.ciiva.com/26336/156674-da-01-en-dc-dc-wandler-1a-tsr-1-2465-26336400.pdf?src-supplier=Conrad; ComponentLink2URL: https://datasheet.ciiva.com/3355/tsr1-eng-tds-3355821.pdf?src-supplier=Distrelec; ComponentLink2Description: https://datasheet.ciiva.com/3355/tsr1-eng-tds-3355821.pdf?src-supplier=Distrelec; Supplier 1: Digi-Key; Supplier 2: Mouser; Supplier Part Number 1: 1951-2611-ND; Supplier Part Number 2: 495-TSR-1-2465
U?#3 = MC33269DTRK-5.0G: Linear Voltage Regulator IC Positive Fixed 1 Output 800mA DPAK; Manufacturer: ON Semiconductor; Accuracy: 1%; Dropout Voltage: 1.1V; Max Input Voltage: 20V; Number of Outputs: 1; Quiescent Current: 20mA; Case/Package: DPAK; Category: Voltage Regulators - Linear; Contact Plating: Tin,Matte; Halogen Free: Halogen Free; Lead Free: Lead Free; Max Operating Temperature: 125°C; Min Current Limit: 800mA; Min Operating Temperature: -40°C; Min Output Voltage: 5V; Mount: Surface Mount; Number of Pins: 3; Number of Regulators: 1; Output Current: 800mA; Output Type: Fixed; Output Voltage: 5V; Output Voltage Accuracy: 1%; Package Quantity: 1; Packaging: Tape and Reel; Polarity: Positive; Radiation Hardening: No; REACH SVHC: No SVHC; RoHS Compliant: Yes; Series: -; ComponentLink1URL: https://datasheet.ciiva.com/2061/mc33269-d-2061282.pdf?src-supplier=Digi-Key; ComponentLink1Description: https://datasheet.ciiva.com/2061/mc33269-d-2061282.pdf?src-supplier=Digi-Key; Supplier 1: Mouser; Supplier 2: Digi-Key; Supplier Part Number 1: 863-MC33269DTRK-5.0G; Supplier Part Number 2: MC33269DTRK-5.0GOSDKR-ND; Manufacturer Part Number: MC33269DTRK-5.0G